# Altium project EJ8_Project.PrjPcb
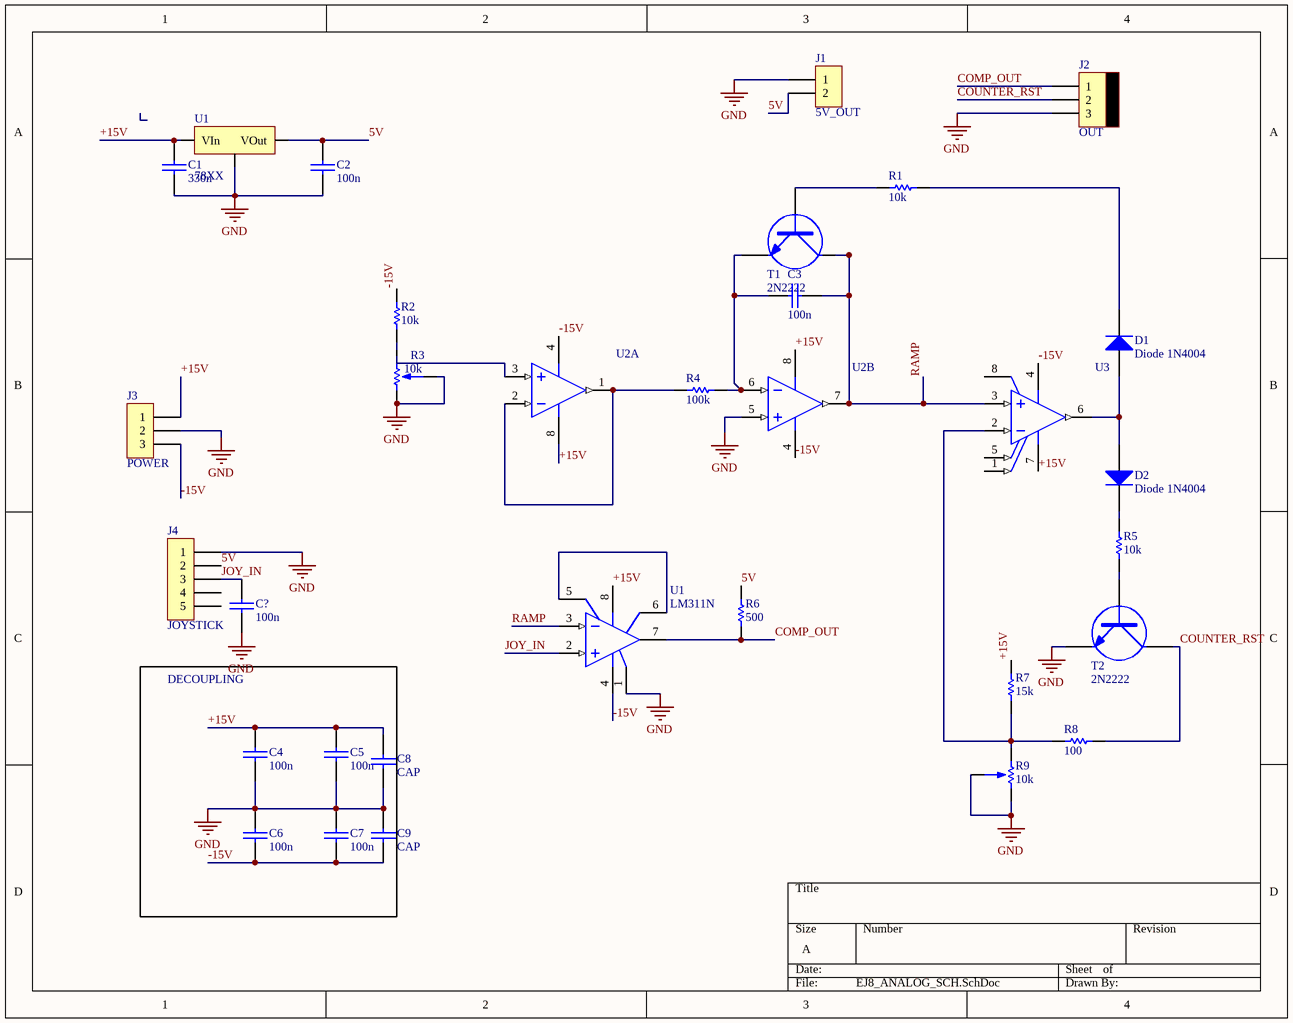
[diagram p0: EJ8_ANALOG_SCH.SchDoc]
2 sheets, 45 parts. Net scope: global (net labels, ports and power ports of the same name join across sheets).
Board files: EJ8_ANALOG_PCB.PcbDoc, EJ8_LOGIC_PCB.PcbDoc
Sheets:
  EJ8_ANALOG_SCH.SchDoc
  EJ8_LOGIC_SCH.SchDoc

## Sheet EJ8_ANALOG_SCH.SchDoc
size A

### Parts
(Parts that share a designator on the sheet are numbered #1, #2 ... from top to bottom, then left to right.)
C1  330n  [CAP200]
C2  100n  [CAP200]
C3  100n  [CAP200]
C4  100n  [0805]
C5  100n  [0805]
C6  100n  [0805]
C7  100n  [0805]
C8  CAP  [0805]
C9  CAP  [0805]
C?  100n  [0805]
D1  Diode 1N4004  [DO-41]
D2  Diode 1N4004  [DO-41]
J1  5V_OUT  [BORNERA2]
J2  OUT  [MOLEX3]
J3  POWER  [BORNERA3]
J4  JOYSTICK  [SIP5]
R1  10k  [0805]
R2  10k  [0805]
R3  10k  [PRESET V]
R4  100k  [RES300]
R5  10k  [0805]
R6  500  [0805]
R7  15k  [RES300]
R8  100  [0805]
R9  10k  [PRESET V]
T1  2N2222  [TO18]
T2  2N2222  [TO18]
U1#1  78XX  [TO-220 V]
U1#2  LM311N  [DIP8]
U2  (no value)  [TI-P8]  (parts A,B of 2)
U3  (no value)  [TI-P8]

### Blocks framed on the sheet
DECOUPLING: C4-C9

### Nets
5V: C2.1 J1.2 J4.2 R6.2 U1#1.3(VOut)
GND: C1.2 C2.2 C4.2 C5.2 C6.1 C7.1 C8.2 C9.1 C?.2 J1.1 J2.3 J3.2 J4.1 R3.2 R3.3 R9.1 R9.2 T2.2(E) U1#1.2(GND) U1#2.1(GND) U2.5(IN2+)
+15V: C1.1 C4.1 C5.1 C8.1 J3.1 R7.2 U1#1.1(VIn) U1#2.8(V+) U2.8(VCC+) U3.7(VCC+)
-15V: C6.2 C7.2 C9.2 J3.3 R2.2 U1#2.4(V-_(CASE)) U2.4(VCC-) U3.4(VCC-)
COMP_OUT: J2.1 R6.1 U1#2.7(OUT)
COUNTER_RST: J2.2 R8.2 T2.3(C)
JOY_IN: C?.1 J4.3 U1#2.2(IN+)
RAMP: C3.2 T1.3(C) U1#2.3(IN-) U2.7(OUT2) U3.3(IN+)
NetC3_1: C3.1 R4.2 T1.2(E) U2.6(IN2-)
NetD1_1: D1.1(A) D2.1(A) U3.6(OUT)
NetD1_2: D1.2(K) R1.2
NetD2_2: D2.2(K) R5.2
NetR1_1: R1.1 T1.1(B)
NetR2_1: R2.1 R3.1
NetR4_1: R4.1 U2.1(OUT1) U2.2(IN1-)
NetR5_1: R5.1 T2.1(B)
NetR7_1: R7.1 R8.1 R9.3 U3.2(IN-)
NetU1#2_5: U1#2.5(BAL) U1#2.6(BAL/STB)

Not connected (* = marked no-connect by the designer): J4 4 5; U2 3(IN1+); U3 1(OFFSET_N1) 5(OFFSET_N2) 8(NC)

### Library data of the parts
C1-C7 C? = CAP
D1 D2 = Diode 1N4004: 1 Amp General Purpose Rectifier; Published: 8-Jun-2000; LatestRevisionDate: 17-Jul-2002; LatestRevisionNote: Re-released for DXP Platform.; DatasheetVersion: 1998; PackageVersion: Aug-1999; PackageReference: DO-41; Publisher: Altium Limited; PackageDescription: Diode, Axial; Body 5.2 x 2.7 mm (LxDia. max), Lead Dia. 0.86 mm (max); Code_JEDEC: DO-204-AL; ComponentLink1Description: Manufacturer Link; ComponentLink1URL: http://www.fairchildsemi.com/; ComponentLink2Description: Datasheet; ComponentLink2URL: http://www.fairchildsemi.com/ds/1N%2F1N4001.pdf
J1 = BORNERA 2
J2 = MOLEX3
J3 = BORNERA 3
J4 = CON5
R1 R2 R4-R8 = RES
R3 R9 = PRESET
U1#1 = 78XX: REGULDOR POSITIVO
U1#2 = LM311N: Voltage Comparator; Published: 24-Aug-2001; LatestRevisionDate: 06-Jun-2005; LatestRevisionNote: Stylized 3D Model Added.; DatasheetVersion: Oct-1997; PackageReference: DIP8; Publisher: Altium Limited; PackageDescription: DIP; 8 Leads; Row Spacing 7.62 mm; Pitch 2.54 mm; Code_JEDEC: MO-001-AN; ComponentLink1Description: Manufacturer Link; ComponentLink1URL: http://www.st.com/; ComponentLink2Description: Datasheet; ComponentLink2URL: http://www.st.com/stonline/products/literature/ds/4848/lm211.pdf
U2 = TL082CP: JFET-Input Operational Amplifier, 7 to 36 V, 0 to 70 degC, 8-pin DIP (P8), Pb-Free (RoHS); Manufacturer: Texas Instruments; CMRR(Min)(dB): 70; GBW(Typ)(MHz): 3; IIB(Max)(pA): 400; Iq per channel(Max)(mA): 2.8; Number of Channels: 2; Offset Drift(Typ)(uV/C): 18; Rating: Catalog; Slew Rate(Typ)(V/us): 13; Sub Family: General Purpose Amplifier, High Supply Voltage Amplifier (>=30V); Total Supply Voltage(Max)(+5V is 5, +/-5V is 10): 36; Total Supply Voltage(Min)(+5V is 5, +/-5V is 10): 7; Vio (25C)(Max)(mV): 15; DatasheetVersion: SLOS081G; PackageVersion: 4040082/E, 04/2010; PackageReference: P8; PackageDescription: 8-Pin Plastic In-Line, Body 9.59 x 6.35 mm, Pitch 2.54 mm; Supplier 1: Digi-Key; Supplier Part Number 1: 296-1780-5-ND; Supplier 2: Farnell; Supplier Part Number 2: 1106017; Supplier 3: Newark; Supplier Part Number 3: 60K6991; Supplier 4: Mouser; Supplier Part Number 4: 595-TL082CP; Eco-Plan: Pb-Free (RoHS); Vn at 1kHz(Typ)(nV/rtHz): 18; Mounting Technology: Through Hole; Code_JEDEC: MS-001; PartNumber: TL082CP; ComponentLink1Description: Manufacturer URL; ComponentLink1URL: http://www.ti.com/; ComponentLink2Description: Datasheet; ComponentLink2URL: http://www.ti.com/lit/ds/symlink/tl082.pdf; ComponentLink3Description: Package Specification; ComponentLink3URL: http://www.ti.com/litv/pdf/mpdi001b; Supplier 5: Mouser; Supplier Part Number 5: N/A
U3 = TL081CP: JFET-Input Operational Amplifier, 7 to 36 V, 0 to 70 degC, 8-pin DIP (P8), Pb-Free (RoHS); Manufacturer: Texas Instruments; CMRR(Min)(dB): 70; GBW(Typ)(MHz): 3; IIB(Max)(pA): 400; Iq per channel(Max)(mA): 2.8; Number of Channels: 1; Offset Drift(Typ)(uV/C): 18; Rating: Military; Slew Rate(Typ)(V/us): 13; Sub Family: General Purpose Amplifier, High Supply Voltage Amplifier (>=30V); Total Supply Voltage(Max)(+5V is 5, +/-5V is 10): 36; Total Supply Voltage(Min)(+5V is 5, +/-5V is 10): 7; Vio (25C)(Max)(mV): 15; DatasheetVersion: SLOS081G; PackageVersion: 4040082/E, 04/2010; PackageReference: P8; PackageDescription: 8-Pin Plastic In-Line, Body 9.59 x 6.35 mm, Pitch 2.54 mm; Supplier 1: Digi-Key; Supplier Part Number 1: 296-7203-5-ND; Supplier 2: Farnell; Supplier Part Number 2: 1103002; Supplier 3: Newark; Supplier Part Number 3: 08F9317; Supplier 4: Mouser; Supplier Part Number 4: 595-TL081CP; Eco-Plan: Pb-Free (RoHS); Vn at 1kHz(Typ)(nV/rtHz): 18; Mounting Technology: Through Hole; Code_JEDEC: MS-001; PartNumber: TL081CP; ComponentLink1Description: Manufacturer URL; ComponentLink1URL: http://www.ti.com/; ComponentLink2Description: Datasheet; ComponentLink2URL: http://www.ti.com/lit/ds/symlink/tl081.pdf; ComponentLink3Description: Package Specification; ComponentLink3URL: http://www.ti.com/litv/pdf/mpdi001b

## Sheet EJ8_LOGIC_SCH.SchDoc
size A
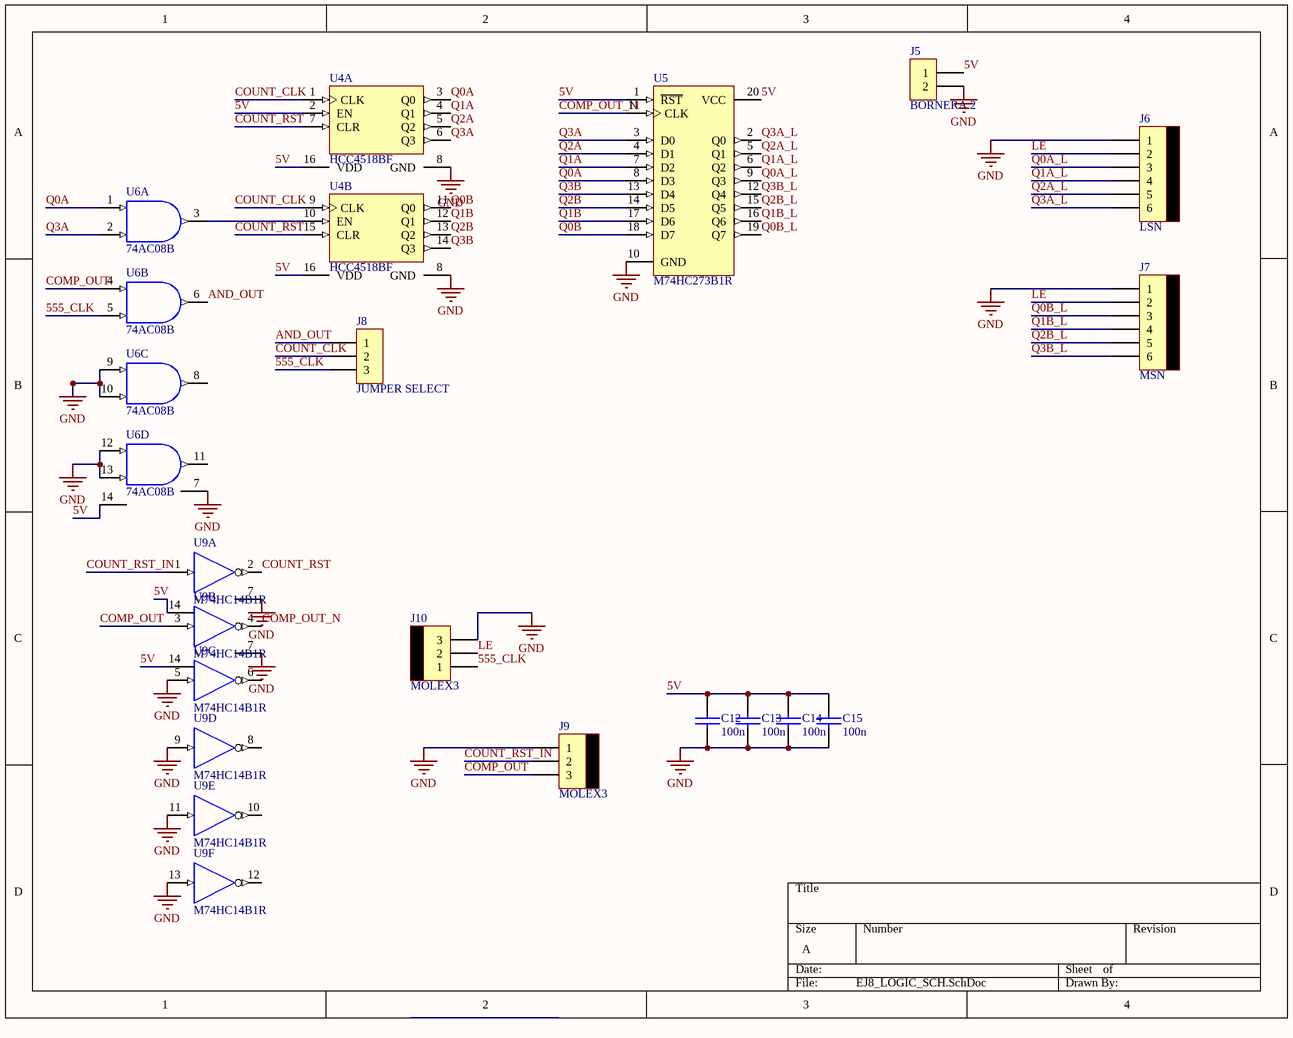
[diagram p1: EJ8_LOGIC_SCH.SchDoc]

### Parts
C12  100n  [0805]
C13  100n  [0805]
C14  100n  [0805]
C15  100n  [0805]
J5  BORNERA 2  [BORNERA2]
J6  LSN  [MOLEX6]
J7  MSN  [MOLEX6]
J8  JUMPER SELECT  [SIP3]
J9  MOLEX3  [MOLEX3]
J10  MOLEX3  [MOLEX3]
U4  HCC4518BF  [DIP16]  (parts A,B of 2)
U5  M74HC273B1R  [DIP20]
U6  74AC08B  [DIP14]  (parts A,B,C,D of 4)
U9  M74HC14B1R  [DIP14]  (parts A,B,C,D,E,F of 6)

### Nets
5V: C12.1 C13.1 C14.1 C15.1 J5.1 U4.2(EN) U4.16(VDD) U5.1(~{RST}) U5.20(VCC) U6.14(VCC) U9.14(VCC)  [also labelled VCC, VDD]
GND: C12.2 C13.2 C14.2 C15.2 J5.2 J6.1 J7.1 J9.1 J10.3 U4.8(GND) U5.10(GND) U6.7(GND) U6.9(A) U6.10(B) U6.12(A) U6.13(B) U9.5(A) U9.7(GND) U9.9(A) U9.11(A) U9.13(A)
555_CLK: J8.3 J10.1 U6.5(B)
AND_OUT: J8.1 U6.6(Y)
COMP_OUT: J9.3 U6.4(A) U9.3(A)
COMP_OUT_N: U5.11(CLK) U9.4(Y)
COUNT_CLK: J8.2 U4.1(CLK) U4.9(CLK)
COUNT_RST: U4.7(CLR) U4.15(CLR) U9.2(Y)
COUNT_RST_IN: J9.2 U9.1(A)
LE: J6.2 J7.2 J10.2
Q0A: U4.3(Q0) U5.8(D3) U6.1(A)
Q0A_L: J6.3 U5.9(Q3)
Q0B: U4.11(Q0) U5.18(D7)
Q0B_L: J7.3 U5.19(Q7)
Q1A: U4.4(Q1) U5.7(D2)
Q1A_L: J6.4 U5.6(Q2)
Q1B: U4.12(Q1) U5.17(D6)
Q1B_L: J7.4 U5.16(Q6)
Q2A: U4.5(Q2) U5.4(D1)
Q2A_L: J6.5 U5.5(Q1)
Q2B: U4.13(Q2) U5.14(D5)
Q2B_L: J7.5 U5.15(Q5)
Q3A: U4.6(Q3) U5.3(D0) U6.2(B)
Q3A_L: J6.6 U5.2(Q0)
Q3B: U4.14(Q3) U5.13(D4)
Q3B_L: J7.6 U5.12(Q4)
NetU4_10: U4.10(EN) U6.3(Y)

Not connected (* = marked no-connect by the designer): U6 8(Y) 11(Y); U9 6(Y) 8(Y) 10(Y) 12(Y)

### Library data of the parts
C12-C15 = CAP
J6 J7 = MOLEX6
J8 = CON3
U4 = HCC4518BF: Dual Decade Up-Counter; Published: 8-Jun-2000; LatestRevisionDate: 06-Jun-2005; LatestRevisionNote: Stylized 3D Model Added.; DatasheetVersion: Jun-1989; PackageVersion: Apr-1996; PackageReference: DIP16; Publisher: Altium Limited; PackageDescription: DIP; 16 Leads; Row Spacing 7.62 mm; Pitch 2.54 mm; ComponentLink1Description: Manufacturer Link; ComponentLink1URL: http://www.st.com/
U5 = M74HC273B1R: Octal D-Type Flip-Flop with Clear; Published: 8-Jun-2000; LatestRevisionDate: 06-Jun-2005; LatestRevisionNote: Stylized 3D Model Added.; DatasheetVersion: Oct-1992; PackageVersion: Jun-1998; PackageReference: DIP20; Publisher: Altium Limited; PackageDescription: DIP; 20 Leads; Row Spacing 7.62 mm; Pitch 2.54 mm; Code_JEDEC: MS-015-AE; ComponentLink1Description: Manufacturer Link; ComponentLink1URL: http://www.st.com/; ComponentLink2Description: Datasheet; ComponentLink2URL: http://www.st.com/stonline/products/literature/ds/1936/m74hc273.pdf
U6 = 74AC08B: Quad 2-Input AND Gate; Published: 8-Jun-2000; LatestRevisionDate: 06-Jun-2005; LatestRevisionNote: Stylized 3D Model Added.; DatasheetVersion: Apr-1997; PackageVersion: Jan-1997; PackageReference: DIP14; Publisher: Altium Limited; PackageDescription: DIP; 14 Leads; Row Spacing 7.62 mm; Pitch 2.54 mm; ComponentLink1Description: Manufacturer Link; ComponentLink1URL: http://www.st.com/; ComponentLink2Description: Datasheet; ComponentLink2URL: http://www.st.com/stonline/products/literature/ds/4694/74ac08.pdf
U9 = M74HC14B1R: Hex Schmitt Inverter; Published: 8-Jun-2000; LatestRevisionDate: 06-Jun-2005; LatestRevisionNote: Stylized 3D Model Added.; DatasheetVersion: Dec-1992; PackageVersion: Jan-1997; PackageReference: DIP14; Publisher: Altium Limited; PackageDescription: DIP; 14 Leads; Row Spacing 7.62 mm; Pitch 2.54 mm; ComponentLink1Description: Manufacturer Link; ComponentLink1URL: http://www.st.com/; ComponentLink2Description: Datasheet; ComponentLink2URL: http://www.st.com/stonline/products/literature/ds/1901/m74hc14.pdf

## Nets that join several sheets
5V: EJ8_ANALOG_SCH (5 pins), EJ8_LOGIC_SCH (11 pins)
GND: EJ8_ANALOG_SCH (21 pins), EJ8_LOGIC_SCH (21 pins)
COMP_OUT: EJ8_ANALOG_SCH (J2.1 R6.1 U1#2.7), EJ8_LOGIC_SCH (J9.3 U6.4 U9.3)